# Altium schematic sheet Power_Line_24V.SchDoc: PDM
size A3; SheetNumber: 5; SheetTotal: 6
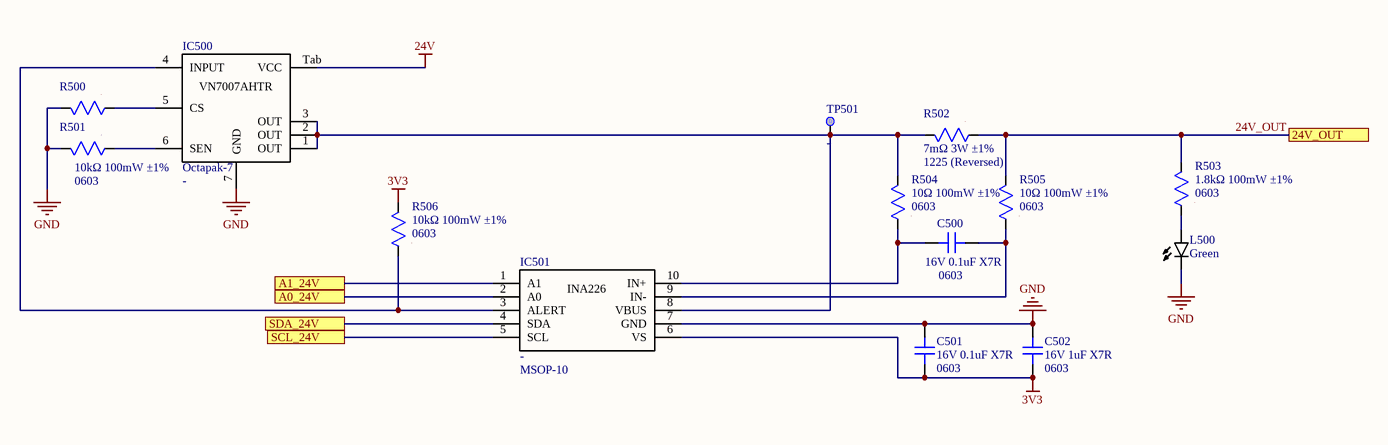
[diagram p0: Power_Line_24V.SchDoc]

## Parts
C500  value 16V 0.1uF X7R  Package: 0603  [CAP SMD 0603]  (hidden comment: CAP non polarized)
C501  value 16V 0.1uF X7R  Package: 0603  [CAP SMD 0603]  (hidden comment: CAP non polarized)
C502  value 16V 1uF X7R  Package: 0603  [CAP SMD 0603]  (hidden comment: CAP non polarized)
IC500  VN7007AHTR  [Octapak-7]  (value not drawn)
IC501  Package: MSOP-10  [VSOP-10]  (hidden comment: INA226)
L500  value Green  [LED SMD 0603]  (hidden comment: LED WHITE)
R500  RES  [RES SMD 0603]  (value not drawn)
R501  value 10kΩ 100mW ±1%  Package: 0603  [RES SMD 0603]  (hidden comment: RES)
R502  value 7mΩ 3W ±1%  Package: 1225 (Reversed)  [RES SMD 1225 Reversed]  (hidden comment: RES)
R503  value 1.8kΩ 100mW ±1%  Package: 0603  [RES SMD 0603]  (hidden comment: RES)
R504  value 10Ω 100mW ±1%  Package: 0603  [RES SMD 0603]  (hidden comment: RES)
R505  value 10Ω 100mW ±1%  Package: 0603  [RES SMD 0603]  (hidden comment: RES)
R506  value 10kΩ 100mW ±1%  Package: 0603  [RES SMD 0603]  (hidden comment: RES)
TP501  Test Point  [TP_SMD_1MM]  (value not drawn)  (no BOM)

## Ports
24V_OUT, A0_24V, A1_24V, SCL_24V, SDA_24V

## Nets
3V3: C501.2 C502.2 IC501.6(VS) R506.2
24V: IC500.Tab(VCC)
GND: C501.1 C502.1 IC500.7(GND) IC501.7(GND) L500.C R500.2 R501.2
24V_OUT: R502.1 R503.2 R505.2 ; port 24V_OUT
A0_24V: IC501.2(A0) ; port A0_24V
A1_24V: IC501.1(A1) ; port A1_24V
SCL_24V: IC501.5(SCL) ; port SCL_24V
SDA_24V: IC501.4(SDA) ; port SDA_24V
NetC500_1: C500.1 IC501.10(IN+) R504.1
NetC500_2: C500.2 IC501.9(IN-) R505.1
NetIC500_1: IC500.1(OUT) IC500.2(OUT) IC500.3(OUT) IC501.8(VBUS) R502.2 R504.2 TP501.1
NetIC500_4: IC500.4(INPUT) IC501.3(ALERT) R506.1
NetIC500_5: IC500.5(CS) R500.1
NetIC500_6: IC500.6(SEN) R501.1
NetL500_A: L500.A R503.1

## Notes on the sheet
- Project:
- Subsystem:
- Company:
- Document:
- Author:
- Revision:
- Date:
- Sheet:
- /

## Library data of the parts
C500 C501 = 001-0112: Condensadores de cerámica multicapa (MLCC- SMD/SMT) WCAP-CSGP 0.1uF 0603 10% 16V MLCC; MPN: 885012206046; Manufacturer: Wurth Elektronik; ComponentLink1Description: Datasheet; ComponentLink1URL: https://www.we-online.com/components/products/datasheet/885012206046.pdf; ComponentLink2Description: Distributor Link; ComponentLink2URL: https://www.mouser.es/ProductDetail/Wurth-Elektronik/885012206046?qs=0KOYDY2FL2%252B89gr6HvTBXA%3D%3D; ID: 001-0112; Distributor PN: 710-885012206046; Distributor: Mouser
C502 = 001-0110: Condensadores de cerámica multicapa (MLCC- SMD/SMT) WCAP-CSGP 1uF 0603 10% 16V MLCC; MPN: 885012206052; Manufacturer: Wurth Elektronik; ComponentLink1Description: Datasheet; ComponentLink1URL: https://www.we-online.com/components/products/datasheet/885012206052.pdf; ComponentLink2Description: Distributor Link; ComponentLink2URL: https://www.mouser.es/ProductDetail/Wurth-Elektronik/885012206052?qs=0KOYDY2FL2%2F2JKabApojcQ%3D%3D; ID: 001-0110; Distributor PN: 710-885012206052; Distributor: Mouser
IC500 = 050-0002: Controlador de puerta High side driver with current sense analog feedback for automotive applications; Manufacturer: 511-VN7007AHTR; ComponentLink1Description: Datasheet; ComponentLink1URL: https://www.st.com/resource/en/datasheet/vn7007ah.pdf; ComponentLink2Description: Distributor Link; ComponentLink2URL: https://www.mouser.es/ProductDetail/STMicroelectronics/VN7007AHTR?qs=mKNKSX85ZJecQmIqUrqpTA%3D%3D; ID: 050-0002; Value: -; Package: Octapak-7; MPN: VN7007AHTR; Distributor PN: STMicroelectronics; Distributor: Mouser
IC501 = 050-0001: Monitores y reguladores de corriente y energía Hi-Side Msmt Bi-Dir Current/Pwr Mon A 59 A 595-INA226AIDGST; MPN: INA226AIDGSR; Manufacturer: 595-INA226AIDGSR; ComponentLink1Description: Datasheet; ComponentLink1URL: https://www.ti.com/lit/ds/symlink/ina226.pdf?ts=1772078114731&ref_url=https%253A%252F%252Fwww.ti.com%252Fproduct%252FINA226; ComponentLink2Description: Distributor Link; ComponentLink2URL: https://www.mouser.es/ProductDetail/Texas-Instruments/INA226AIDGSR?qs=tQG3bEuiOZD4quG3egR36g%3D%3D&srsltid=AfmBOopOjh8KVXQVeHwZlO8DxeOetC6-xgaoNkKslHEV4iGJ_SkIIo7K; ID: 050-0001; Value: -; Distributor PN: Texas Instruments; Distributor: Mouser
L500 = 033-0023: LED de un solo color Green 525nm 1400mcd 2.85V 73deg 0603; MPN: VLMTG1400-GS08; Manufacturer: Vishay Semiconductors; ComponentLink1Description: Datasheet; ComponentLink1URL: https://www.vishay.com/docs/84393/vlmtg1400.pdf; ComponentLink2Description: Distributor Link; ComponentLink2URL: https://www.mouser.es/ProductDetail/Vishay-Semiconductors/VLMTG1400-GS08?qs=gt1LBUVyoHlZ6yHd8iEIzQ%3D%3D; ID: 033-0023; Package: 0603; Distributor PN: 78-VLMTG1400-GS08; Distributor: Mouser
R500 = 010-0145: Resistores de película gruesa - SMD WRIS-RSKS 10 kOhms 1 % 0.1 W 0603 AEC-Q200; MPN: 560112116005; Manufacturer: Wurth Elektronik; Value: 10kΩ 100mW ±1%; ComponentLink1Description: Datasheet; ComponentLink1URL: https://www.we-online.com/components/products/datasheet/560112116005.pdf; ComponentLink2Description: Distributor Link; ComponentLink2URL: https://www.mouser.es/ProductDetail/Wurth-Elektronik/560112116005?qs=mELouGlnn3dMVSPHwBGouA%3D%3D; Package: 0603; ID: 010-0145; Distributor PN: 710-560112116005; Distributor: Mouser
R501 R506 = 010-0145: Resistores de película gruesa - SMD WRIS-RSKS 10 kOhms 1 % 0.1 W 0603 AEC-Q200; MPN: 560112116005; Manufacturer: Wurth Elektronik; ComponentLink1Description: Datasheet; ComponentLink1URL: https://www.we-online.com/components/products/datasheet/560112116005.pdf; ComponentLink2Description: Distributor Link; ComponentLink2URL: https://www.mouser.es/ProductDetail/Wurth-Elektronik/560112116005?qs=mELouGlnn3dMVSPHwBGouA%3D%3D; ID: 010-0145; Distributor PN: 710-560112116005; Distributor: Mouser
R502 = 015-0003: Resistores de detección de corriente - SMD 3W 0.007ohm 1% 50ppm; MPN: KRL6432E-M-R007-F-T1; Manufacturer: Susumu; ComponentLink1Description: Datasheet; ComponentLink1URL: https://www.mouser.es/datasheet/3/826/1/n_catalog_partition19_en.pdf; ComponentLink2Description: Distributor Link; ComponentLink2URL: https://www.mouser.es/ProductDetail/Susumu/KRL6432E-M-R007-F-T1?qs=FG09h9tFCuA5fgBuyupdEw%3D%3D; ID: 015-0003; Distributor PN: 754-KRL6432EMR007FT1; Distributor: Mouser
R503 = 010-0146: Resistores de película gruesa - SMD WRIS-RSKS 1.8 kOhms 1 % 0.1 W 0603 AEC-Q200; MPN: 560112116032; Manufacturer: Wurth Elektronik; ComponentLink1Description: Datasheet; ComponentLink1URL: https://www.we-online.com/components/products/datasheet/560112116032.pdf; ComponentLink2Description: Distributor Link; ComponentLink2URL: https://www.mouser.es/ProductDetail/Wurth-Elektronik/560112116032?qs=mELouGlnn3dPZZEXKb4zAQ%3D%3D; ID: 010-0146; Distributor PN: 710-560112116032; Distributor: Mouser
R504 R505 = 010-0149: Resistores de película gruesa - SMD WRIS-RSKS 10 Ohms 1 % 0.1 W 0603 AEC-Q200; MPN: 560112116013; Manufacturer: Wurth Elektronik; ComponentLink1Description: Datasheet; ComponentLink1URL: https://www.we-online.com/components/products/datasheet/560112116013.pdf; ComponentLink2Description: Distributor Link; ComponentLink2URL: https://www.mouser.es/ProductDetail/Wurth-Elektronik/560112116013?qs=mELouGlnn3f7quibYlpocQ%3D%3D; ID: 010-0149; Distributor PN: 710-560112116013; Distributor: Mouser
TP501 = 110-0007: ComponentLink1URL: -; ComponentLink1Description: Datasheet; ComponentLink1URL: *; ComponentLink2Description: Distributor Link; ComponentLink2URL: -; ID: 110-0007; Value: -; Package: -; MPN: -; Manufacturer: -; Distributor PN: -; Distributor: -